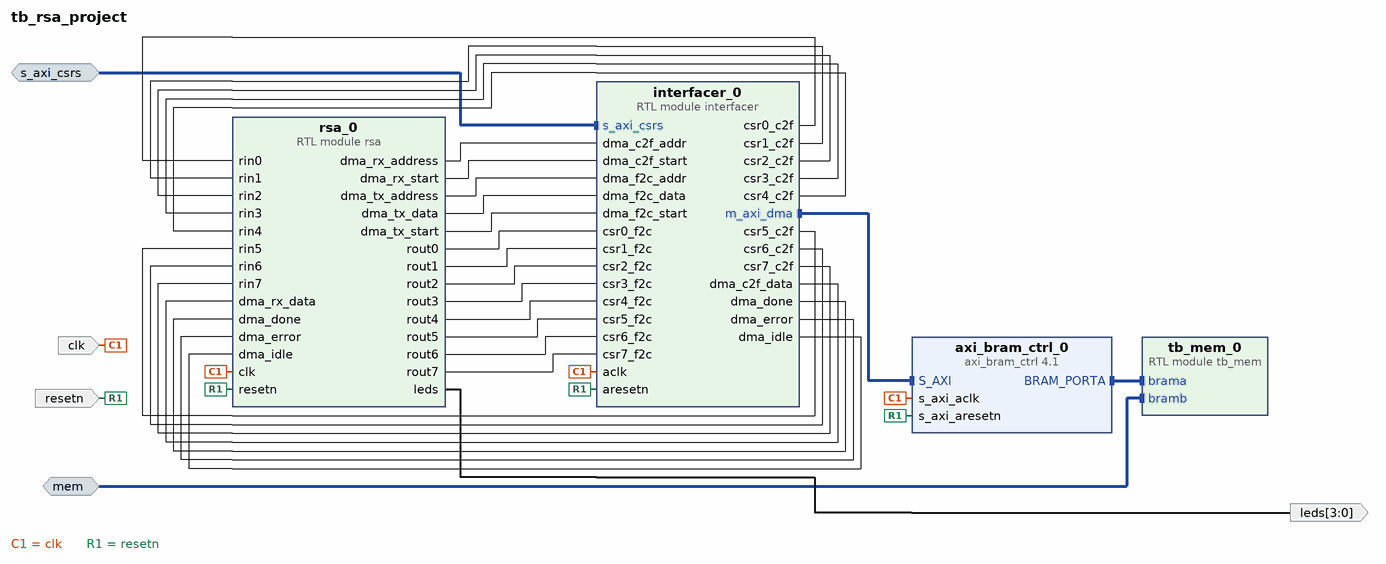
[diagram p0: block diagram of the top level]
# Vivado block design tb_rsa_project, xc7z020clg400-1, Vivado 2023.1
create_bd_design tb_rsa_project

create_bd_intf_port -mode Slave -vlnv xilinx.com:interface:bram_rtl:1.0 mem
set_property -dict [list \
  CONFIG.MASTER_TYPE BRAM_CTRL \
  CONFIG.MEM_SIZE 16384 \
  CONFIG.MEM_WIDTH 1024 \
  CONFIG.READ_WRITE_MODE READ_WRITE \
] [get_bd_intf_ports mem]
create_bd_intf_port -mode Slave -vlnv xilinx.com:interface:aximm_rtl:1.0 s_axi_csrs
set_property -dict [list \
  CONFIG.ADDR_WIDTH 12 \
  CONFIG.ARUSER_WIDTH 0 \
  CONFIG.AWUSER_WIDTH 0 \
  CONFIG.BUSER_WIDTH 0 \
  CONFIG.CLK_DOMAIN rsa_project_processing_system7_0_0_FCLK_CLK0 \
  CONFIG.DATA_WIDTH 32 \
  CONFIG.HAS_BRESP 1 \
  CONFIG.HAS_BURST 0 \
  CONFIG.HAS_CACHE 0 \
  CONFIG.HAS_LOCK 0 \
  CONFIG.HAS_PROT 0 \
  CONFIG.HAS_QOS 0 \
  CONFIG.HAS_REGION 0 \
  CONFIG.HAS_RRESP 1 \
  CONFIG.HAS_WSTRB 1 \
  CONFIG.ID_WIDTH 0 \
  CONFIG.MAX_BURST_LENGTH 1 \
  CONFIG.NUM_READ_OUTSTANDING 1 \
  CONFIG.NUM_READ_THREADS 4 \
  CONFIG.NUM_WRITE_OUTSTANDING 1 \
  CONFIG.NUM_WRITE_THREADS 4 \
  CONFIG.PROTOCOL AXI4LITE \
  CONFIG.READ_WRITE_MODE READ_WRITE \
  CONFIG.RUSER_BITS_PER_BYTE 0 \
  CONFIG.RUSER_WIDTH 0 \
  CONFIG.SUPPORTS_NARROW_BURST 0 \
  CONFIG.WUSER_BITS_PER_BYTE 0 \
  CONFIG.WUSER_WIDTH 0 \
] [get_bd_intf_ports s_axi_csrs]
create_bd_port -dir I -type clk clk
set_property -dict {CONFIG.CLK_DOMAIN rsa_project_processing_system7_0_0_FCLK_CLK0 CONFIG.FREQ_HZ 100000000} [get_bd_ports clk]
create_bd_port -dir O -from 3 -to 0 leds
create_bd_port -dir I -type rst resetn

create_bd_cell -type ip -vlnv xilinx.com:ip:axi_bram_ctrl:4.1 axi_bram_ctrl_0
set_property -dict {CONFIG.DATA_WIDTH 1024 CONFIG.SINGLE_PORT_BRAM 1} [get_bd_cells axi_bram_ctrl_0]
create_bd_cell -type module -reference tb_mem tb_mem_0
create_bd_cell -type module -reference interfacer interfacer_0
create_bd_cell -type module -reference rsa rsa_0

# ---- connections ----

connect_bd_intf_net [get_bd_intf_pins axi_bram_ctrl_0/BRAM_PORTA] [get_bd_intf_pins tb_mem_0/brama]
connect_bd_intf_net [get_bd_intf_pins axi_bram_ctrl_0/S_AXI] [get_bd_intf_pins interfacer_0/m_axi_dma]
connect_bd_intf_net [get_bd_intf_pins tb_mem_0/bramb] [get_bd_intf_ports mem]
connect_bd_intf_net [get_bd_intf_pins interfacer_0/s_axi_csrs] [get_bd_intf_ports s_axi_csrs]
connect_bd_net [get_bd_ports clk] [get_bd_pins axi_bram_ctrl_0/s_axi_aclk] [get_bd_pins interfacer_0/aclk] [get_bd_pins rsa_0/clk]
connect_bd_net [get_bd_pins interfacer_0/csr0_c2f] [get_bd_pins rsa_0/rin0]
connect_bd_net [get_bd_pins interfacer_0/csr1_c2f] [get_bd_pins rsa_0/rin1]
connect_bd_net [get_bd_pins interfacer_0/csr2_c2f] [get_bd_pins rsa_0/rin2]
connect_bd_net [get_bd_pins interfacer_0/csr3_c2f] [get_bd_pins rsa_0/rin3]
connect_bd_net [get_bd_pins interfacer_0/csr4_c2f] [get_bd_pins rsa_0/rin4]
connect_bd_net [get_bd_pins interfacer_0/csr5_c2f] [get_bd_pins rsa_0/rin5]
connect_bd_net [get_bd_pins interfacer_0/csr6_c2f] [get_bd_pins rsa_0/rin6]
connect_bd_net [get_bd_pins interfacer_0/csr7_c2f] [get_bd_pins rsa_0/rin7]
connect_bd_net [get_bd_pins interfacer_0/dma_c2f_data] [get_bd_pins rsa_0/dma_rx_data]
connect_bd_net [get_bd_pins interfacer_0/dma_done] [get_bd_pins rsa_0/dma_done]
connect_bd_net [get_bd_pins interfacer_0/dma_error] [get_bd_pins rsa_0/dma_error]
connect_bd_net [get_bd_pins interfacer_0/dma_idle] [get_bd_pins rsa_0/dma_idle]
connect_bd_net [get_bd_pins rsa_0/dma_rx_address] [get_bd_pins interfacer_0/dma_c2f_addr]
connect_bd_net [get_bd_pins rsa_0/dma_rx_start] [get_bd_pins interfacer_0/dma_c2f_start]
connect_bd_net [get_bd_pins rsa_0/dma_tx_address] [get_bd_pins interfacer_0/dma_f2c_addr]
connect_bd_net [get_bd_pins rsa_0/dma_tx_data] [get_bd_pins interfacer_0/dma_f2c_data]
connect_bd_net [get_bd_pins rsa_0/dma_tx_start] [get_bd_pins interfacer_0/dma_f2c_start]
connect_bd_net [get_bd_pins rsa_0/leds] [get_bd_ports leds]
connect_bd_net [get_bd_pins rsa_0/rout0] [get_bd_pins interfacer_0/csr0_f2c]
connect_bd_net [get_bd_pins rsa_0/rout1] [get_bd_pins interfacer_0/csr1_f2c]
connect_bd_net [get_bd_pins rsa_0/rout2] [get_bd_pins interfacer_0/csr2_f2c]
connect_bd_net [get_bd_pins rsa_0/rout3] [get_bd_pins interfacer_0/csr3_f2c]
connect_bd_net [get_bd_pins rsa_0/rout4] [get_bd_pins interfacer_0/csr4_f2c]
connect_bd_net [get_bd_pins rsa_0/rout5] [get_bd_pins interfacer_0/csr5_f2c]
connect_bd_net [get_bd_pins rsa_0/rout6] [get_bd_pins interfacer_0/csr6_f2c]
connect_bd_net [get_bd_pins rsa_0/rout7] [get_bd_pins interfacer_0/csr7_f2c]
connect_bd_net -net rst_ps7_0_100M_peripheral_aresetn [get_bd_ports resetn] \
  [get_bd_pins axi_bram_ctrl_0/s_axi_aresetn] [get_bd_pins interfacer_0/aresetn] [get_bd_pins rsa_0/resetn]

# ---- address map ----
assign_bd_address -offset 0x00000000 -range 16K -target_address_space [get_bd_addr_spaces interfacer_0/m_axi_dma] [get_bd_addr_segs axi_bram_ctrl_0/S_AXI/Mem0]
assign_bd_address -offset 0x000 -range 4K -target_address_space [get_bd_addr_spaces s_axi_csrs] [get_bd_addr_segs interfacer_0/s_axi_csrs/reg0]

validate_bd_design
save_bd_design
